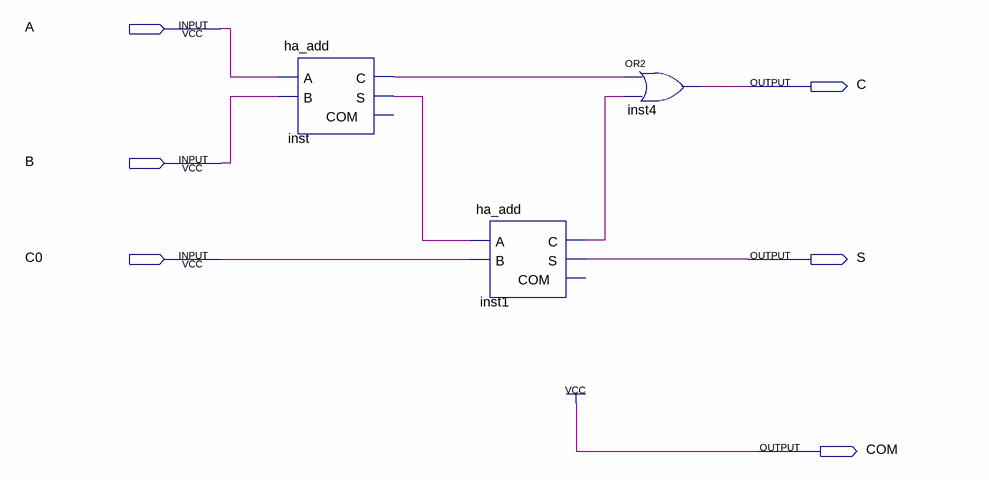
[diagram p0: schematic sheet]
// Quartus schematic fa_add.bdf as structural Verilog: 3 symbols, 6 pins
module fa_add (
  input  A,
  input  B,
  input  C0,
  output C,
  output S,
  output COM
);

  wire inst1_c, inst_c, inst_s;

  ha_add inst (.A(A), .B(B), .C(inst_c), .S(inst_s));  // open: COM
  ha_add inst1 (.A(inst_s), .B(C0), .C(inst1_c), .S(S));  // open: COM
  or inst4 (C, inst_c, inst1_c);

  assign COM = 1'b1;
endmodule
